# Altium schematic sheet Power.SchDoc
size A2; SheetNumber: 1; SheetTotal: 2
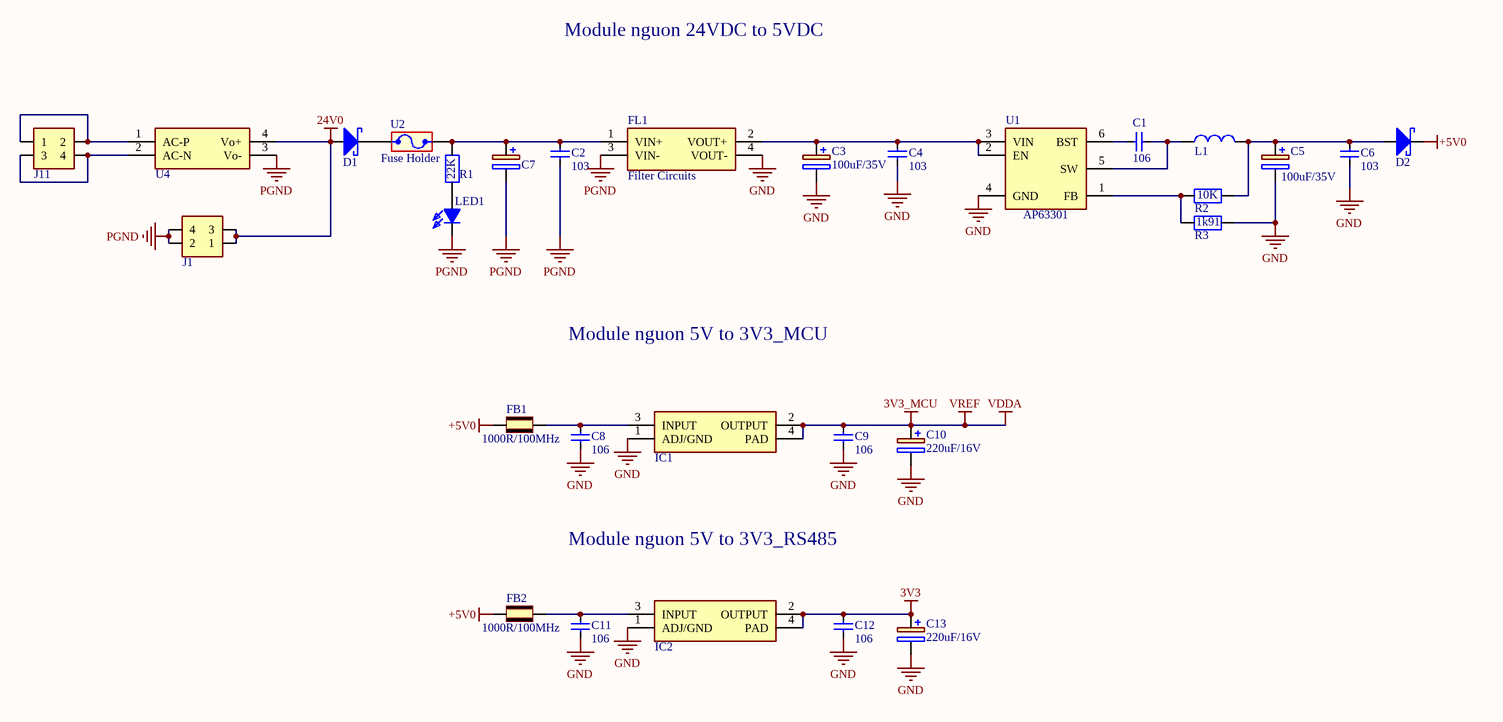
[diagram p0: Power.SchDoc]

## Parts
C1  106  [CAPC1608X95N]
C2  103  [CAPC1608X95N]
C3  100uF/35V  [CAPAE850X1050N]
C4  103  [CAPC1608X95N]
C5  100uF/35V  [CAPAE850X1050N]
C6  103  [CAPC1608X95N]
C7  330uF/35V  [CAPAE1000X1270N]  (value not drawn)
C8  106  [CAPC1608X95N]
C9  106  [CAPC1608X95N]
C10  220uF/16V  [CAPPM7344X430N]
C11  106  [CAPC1608X95N]
C12  106  [CAPC1608X95N]
C13  220uF/16V  [CAPPM7344X430N]
D1  40V/5A  [SODFL3517X110N]  (value not drawn)
D2  40V/5A  [SODFL3517X110N]  (value not drawn)
FB1  1000R/100MHz  [BEADC2012X110N]
FB2  1000R/100MHz  [BEADC2012X110N]
FL1  Filter Circuits  [BNX024H01K]
IC1  3V3-1A  [SOT230P700X180-4N]  (value not drawn)
IC2  3V3-1A  [SOT230P700X180-4N]  (value not drawn)
J1  Connector THD 4 position 0.165" (4.20mm)  [RHDR4W125P550X420_2X2_960X960X1310P]  (value not drawn)
J11  Connector THD 4 position 0.165" (4.20mm)  [RHDR4W125P550X420_2X2_960X960X1310P]  (value not drawn)
L1  Inductor 4.7uH/2A  [WE-PD2_453255]  (value not drawn)
LED1  LED0603_BLUE  [LEDC1608X80N]  (value not drawn)
R1  22k  [RESC1608X55N]  (value not drawn)
R2  10k  [RESC1608X55N]  (value not drawn)
R3  Res 0603 1k91  [RESC1608X55N]  (value not drawn)
U1  AP63301  [SOT95P280X100-6N]
U2  Fuse Holder  [01550900M]
U4  AC/DC CONVERTER 24V 20W  [HLK-20M24]  (value not drawn)

## Nets
3V3: C12.2 C13.1(+) IC2.2(OUTPUT) IC2.4(PAD)
3V3_MCU: C9.2 C10.1(+) IC1.2(OUTPUT) IC1.4(PAD)  [also labelled VDDA, VREF]
24V0: D1.2(A) J1.1 J1.3 U4.4(Vo+)
+5V0: D2.1(K) FB1.1 FB2.1
GND: C3.2(-) C4.1 C5.2(-) C6.1 C8.1 C9.1 C10.2(-) C11.1 C12.1 C13.2(-) FL1.4(VOUT-) IC1.1(ADJ/GND) IC2.1(ADJ/GND) R3.2 U1.4(GND)
PGND: C2.1 C7.2(-) FL1.3(VIN-) J1.2 J1.4 LED1.1(K) U4.3(Vo-)
NetC1_1: C1.1 U1.6(BST)
NetC1_2: C1.2 L1.1 U1.5(SW)
NetC2_2: C2.2 C7.1(+) FL1.1(VIN+) R1.2 U2.2
NetC3_1: C3.1(+) C4.2 FL1.2(VOUT+) U1.2(EN) U1.3(VIN)
NetC5_1: C5.1(+) C6.2 D2.2(A) L1.2 R2.2
NetC8_2: C8.2 FB1.2 IC1.3(INPUT)
NetC11_2: C11.2 FB2.2 IC2.3(INPUT)
NetD1_1: D1.1(K) U2.1
NetJ11_1: J11.1 J11.2 U4.1(AC-P)
NetJ11_3: J11.3 J11.4 U4.2(AC-N)
NetLED1_2: LED1.2(A) R1.1
NetR2_1: R2.1 R3.1 U1.1(FB)

## Notes on the sheet
- Module nguon 24VDC to 5VDC
- Module nguon 5V to 3V3_MCU
- Module nguon 5V to 3V3_RS485
- (in symbol Res 0603 1k91) 1k91
- (in symbol Res 0603 10k) 10K
- (in symbol Res 0603 22k) 22K

## Library data of the parts
C1 C8 C9 C11 C12 = Cap 106 - 0603: Cap 10uF 10v 0603 SMD 10% X7R Phycomp 10nF Multilayer Ceramic Capacitor (MLCC) 10 V dc +/-10% X7R dielectric Standard max op. temp. +125C; Manufacturer_Name: Murata Electronics; Manufacturer_Part_Number: GRM188D71A106KA73D; Datasheet Link: https://psearch.en.murata.com/capacitor/product/GRM188D71A106KA73%23.html; Height: 0.9mm; Mouser Part Number: 81-GRM188D71A106KA3D; Mouser Price/Stock: https://www.mouser.co.uk/ProductDetail/Murata-Electronics/GRM188D71A106KA73D?qs=FvQ4nYu%252B2He2GIhYKxXmMQ%3D%3D; Arrow Part Number: GRM188D71A106KA73D; Arrow Price/Stock: https://www.arrow.com/en/products/grm188d71a106ka73d/murata-manufacturing?region=nac
C2 C4 C6 = Cap 103 - 0603: Cap 10nF 50v 0603 SMD 10% X7R Phycomp 10nF Multilayer Ceramic Capacitor (MLCC) 50 V dc +/-10% X7R dielectric Standard max op. temp. +125C; Manufacturer_Name: KEMET; Manufacturer_Part_Number: CC0603KRX7R9BB103; Datasheet Link: https://datasheet.datasheetarchive.com/originals/distributors/Datasheets_SAMA/d9f127a4875522309d99aa7dec79633c.pdf; Height: 0.9mm; Mouser Part Number: 603-CC603KRX7R9BB103; Mouser Price/Stock: https://www.mouser.co.uk/ProductDetail/YAGEO/CC0603KRX7R9BB103?qs=AgBp2OyFlx%252BeoRRspw6PJg%3D%3D; Arrow Part Number: CC0603KRX7R9BB103; Arrow Price/Stock: https://www.arrow.com/en/products/cc0603krx7r9bb103/yageo?region=nac
C3 C5 = Cap smd 100uF/35V: Aluminium Electrolytic Capacitors - SMD 100UF 35V 105C 2500H; Manufacturer_Name: Vishay; Manufacturer_Part_Number: MAL215097011E3; Datasheet Link: http://www.vishay.com/docs/28395/150crz.pdf; Height: 10.5mm; Mouser Part Number: 594-MAL215097011E3; Mouser Price/Stock: https://www.mouser.co.uk/ProductDetail/Vishay-BC-Components/MAL215097011E3?qs=qmStTZH4TzmmMfVG5I6TQQ%3D%3D; Arrow Part Number: MAL215097011E3; Arrow Price/Stock: https://www.arrow.com/en/products/mal215097011e3/vishay
C7 = Cap smd 330uF/35V: Aluminum Organic Polymer Capacitors 35Vol 330uF SMD 2KHr ESR=22 mOhms AECQ200; Manufacturer_Name: KEMET; Manufacturer_Part_Number: A768MS337M1VLAS022; Datasheet Link: https://search.kemet.com/component-documentation/download/specsheet/A768MS337M1VLAS022; Height: 12.7mm; Mouser Part Number: 80-A768MS337M1VLAS22; Mouser Price/Stock: https://www.mouser.co.uk/ProductDetail/KEMET/A768MS337M1VLAS022?qs=sPbYRqrBIVliRmrbB6XsUw%3D%3D; Arrow Part Number: A768MS337M1VLAS022; Arrow Price/Stock: https://www.arrow.com/en/products/a768ms337m1vlas022/kemet-corporation?region=nac
C10 C13 = Cap smd 220uF/16V: Tantalum Capacitors - Solid SMD 16V 220uF 10% 2917 Multi-anode; Manufacturer_Name: Kyocera AVX; Manufacturer_Part_Number: TPME227K016R0025; Datasheet Link: http://datasheets.avx.com/TPM.pdf; Height: 4.3mm; Mouser Part Number: 581-TPME227K016R0025; Mouser Price/Stock: https://www.mouser.com/Search/Refine.aspx?Keyword=581-TPME227K016R0025
D1 D2 = Diode 40V/5A: DIODE SCHOTTKY 40V 5A SMA; Manufacturer_Name: Nexperia; Manufacturer_Part_Number: PMEG40T30ERX; Datasheet Link: https://assets.nexperia.com/documents/data-sheet/PMEG40T30ER.pdf; Height: 1.1mm; Mouser Part Number: 771-PMEG40T30ERX; Mouser Price/Stock: https://www.mouser.co.uk/ProductDetail/Nexperia/PMEG40T30ERX?qs=1mbolxNpo8eeG%2Fr5KLvXLA%3D%3D; Arrow Part Number: PMEG40T30ERX; Arrow Price/Stock: https://www.arrow.com/en/products/pmeg40t30erx/nexperia?region=europe
FB1 FB2 = Ferrite Bead 1000R 100MHz: Ferrite Beads 1000ohms 100MHz 1A Monolithic 0805 SMD; Manufacturer_Name: Laird-Signal Integrity Products; Manufacturer_Part_Number: MI0805J102R-10; Datasheet Link: https://www.laird.com/sites/default/files/mi0805j102r-10-datasheet.pdf; Height: 1.1mm
FL1 = Filter: EMI Filter Circuits 10.0 UF 50V 20A; Manufacturer_Name: Murata Electronics; Manufacturer_Part_Number: BNX026H01L; Datasheet Link: https://www.murata.com/en-us/products/productdetail?partno=BNX026H01%23; Height: 3.7mm; Mouser Part Number: 81-BNX026H01L; Mouser Price/Stock: https://www.mouser.co.uk/ProductDetail/Murata-Electronics/BNX026H01L?qs=zU3EaVYbc3y78A%2FfsSIPhQ%3D%3D; Arrow Part Number: BNX026H01L; Arrow Price/Stock: https://www.arrow.com/en/products/bnx026h01l/murata-manufacturing?utm_currency=USD&region=nac
IC1 IC2 = AMS1117-3V3: LDO Voltage Regulators 800MA LDO LINEAR REG A 926-LM1117IMP3.3NOPB; Manufacturer_Name: Texas Instruments; Manufacturer_Part_Number: LM1117IMPX3.3/NOPB; Datasheet Link: http://www.ti.com/lit/ds/symlink/lm1117.pdf; Height: 1.8mm
J1 J11 = Connector 2x2: Connector Header Through Hole 4 position 0.165" (4.20mm); Manufacturer_Name: Molex; Manufacturer_Part_Number: 0039281043; Datasheet Link: https://www.molex.com/pdm_docs/sd/039281043_sd.pdf; Height: 13.1mm; Mouser Part Number: N/A; Mouser Price/Stock: https://www.mouser.co.uk/ProductDetail/Molex/0039281043?qs=PBcRNPEHKsoXjYsIax3FJA%3D%3D; Arrow Part Number: 0039281043; Arrow Price/Stock: https://www.arrow.com/en/products/0039281043/molex?utm_currency=USD&region=nac
L1 = Inductor 4.7uH/2A: Power Inductors - SMD WE-PD2 4532 4.7uH 1.82A .11Ohm; Manufacturer_Name: Wurth Elektronik; Manufacturer_Part_Number: 744773047; Mouser Part Number: 710-744773047; Mouser Price/Stock: https://www.mouser.co.uk/ProductDetail/Wurth-Elektronik/744773047?qs=rS3zZhy2AQMDGJWCDZKEvg%3D%3D
LED1 = LED0603_BLUE: LED; Manufacturer_Name: Wurth Elektronik; Manufacturer_Part_Number: 150060BS75000; Datasheet Link: https://componentsearchengine.com/Datasheets/2/150060BS75000.pdf; Height: 0.8mm; Mouser Part Number: 710-150060BS75000; Mouser Price/Stock: https://www.mouser.co.uk/ProductDetail/Wurth-Elektronik/150060BS75000?qs=LlUlMxKIyB2DLLpXQThavA%3D%3D
R1 = Res 0603 22k: Thick Film Resistors - SMD 22 kOhms 100mW 0603 1%; Manufacturer_Name: Panasonic; Manufacturer_Part_Number: ERJ-UP3J223V; Datasheet Link: https://industrial.panasonic.com/cdbs/www-data/pdf/RDP0000/AOA0000C337.pdf; Height: 0.55mm; Mouser Part Number: 667-ERJ-UP3J223V; Mouser Price/Stock: https://www.mouser.co.uk/ProductDetail/Panasonic/ERJ-UP3J223V?qs=GedFDFLaBXHkpI8RZhFc4A%3D%3D
R2 = Res 0603 10k: Resistor 10 kOhms ±1% 0.1W, 1/10W Chip Resistor 0603 (1608 Metric) Automotive AEC-Q200 Thick Film; Manufacturer_Name: Panasonic; Manufacturer_Part_Number: ERJ-3EKF1002V; Datasheet Link: http://industrial.panasonic.com/cdbs/www-data/pdf/RDA0000/AOA0000C86.pdf; Height: 0.55mm; Mouser Part Number: 667-ERJ-3EKF1002V; Mouser Price/Stock: https://www.mouser.co.uk/ProductDetail/Panasonic/ERJ-3EKF1002V?qs=H7k1u0Mp9JSrGPQ5%2F5COuw%3D%3D; Arrow Part Number: ERJ-3EKF1002V; Arrow Price/Stock: https://www.arrow.com/en/products/erj-3ekf1002v/panasonic?region=europe
R3 = Res 0603 1k91: Thick Film Resistors - SMD 1.91K 1% 1/10W; Manufacturer_Name: Bourns; Manufacturer_Part_Number: CR0603-FX-1911ELF; Datasheet Link: https://www.bourns.com/pdfs/chpreztr.pdf; Height: 0.55mm; Mouser Part Number: 652-CR0603FX-1911ELF; Mouser Price/Stock: https://www.mouser.com/Search/Refine.aspx?Keyword=652-CR0603FX-1911ELF
U1 = AP63301: Switching Voltage Regulators DCDC Conv HV Buck TSOT26 T&R 3K; Manufacturer_Name: Diodes Incorporated; Manufacturer_Part_Number: AP63301WU-7; Datasheet Link: https://www.diodes.com//assets/Datasheets/AP63300-AP63301.pdf; Height: 1mm; Mouser Part Number: 621-AP63301WU-7; Mouser Price/Stock: https://www.mouser.co.uk/ProductDetail/Diodes-Incorporated/AP63301WU-7?qs=bZr6mbWTK5mxozg17S0lNg%3D%3D; Arrow Part Number: AP63301WU-7; Arrow Price/Stock: https://www.arrow.com/en/products/ap63301wu-7/diodes-incorporated?region=nac
U2 = Fuse Holder: Fuse Holder ACS NANO HLDR; Manufacturer_Name: LITTELFUSE; Datasheet Link: http://www.littelfuse.com/~/media/electronics/datasheets/fuses/littelfuse_fuse_154_154t_154l_154tl_datasheet.pdf.pdf; Height: 3.81mm; Manufacturer_Part_Number: 01550900M; Mouser Part Number: 576-01550900M; Mouser Price/Stock: https://www.mouser.co.uk/ProductDetail/Littelfuse/01550900M?qs=DDoybve0rC%252BTXq1hqi5X1g%3D%3D; Arrow Part Number: 01550900M; Arrow Price/Stock: https://www.arrow.com/en/products/01550900m/littelfuse?utm_currency=USD&region=europe
U4 = HLK-20M24: AC/DC CONVERTER 24V 20WEnclosed AC DC Converters 1 Output 24V 830mA 85 ~ 264 VAC, 120 ~ 370 VDC Input